# Altium schematic sheet Real Time Clock.SchDoc: Real Time Clock
size A4; SheetNumber: 36; SheetTotal: 37
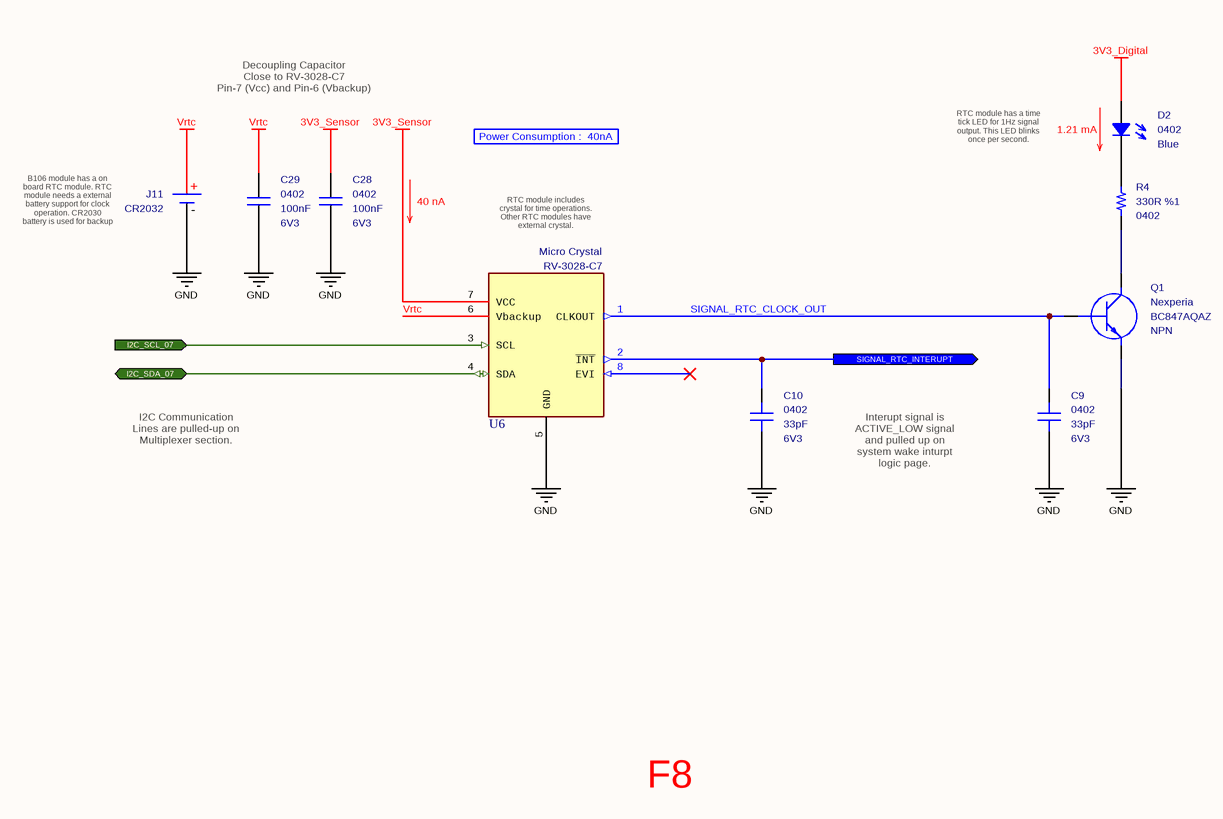
[diagram p0: Real Time Clock.SchDoc]

## Parts
C9  value 33pF  Case: 0402  Voltage: 6V3  [CAPACITOR_0402]  (hidden comment: Multilayer Ceramic Capacitor)
C10  value 33pF  Case: 0402  Voltage: 6V3  [CAPACITOR_0402]  (hidden comment: Multilayer Ceramic Capacitor)
C28  value 100nF  Case: 0402  Voltage: 6V3  [CAPACITOR_0402]  (hidden comment: Multilayer Ceramic Capacitor)
C29  value 100nF  Case: 0402  Voltage: 6V3  [CAPACITOR_0402]  (hidden comment: Multilayer Ceramic Capacitor)
D2  Case: 0402  Color: Blue  [LED_0402]  (hidden comment: SMD LED (Blue))
J11  Battery Size: CR2032  [BATTERY_HOLDER - CR2032]  (hidden comment: Battery Clip Holder and Battery)
Q1  Manufacturer_Name: Nexperia  Manufacturer_Part_Number: BC847AQAZ  Polarity: NPN  [SOT1215]  (hidden comment: Bipolar NPN Transistors)
R4  value 330R  Tolerance: %1  Case: 0402  [RESISTOR_0402]  (hidden comment: Thick Film Resistor)
U6  Manufacturer_Name: Micro Crystal  [RV-3028-C7]  (hidden comment: Real Time Clock)

## Ports
I2C_SCL_07 (in), I2C_SDA_07 (bidir), SIGNAL_RTC_INTERUPT (out)

## Nets
3V3_Digital: D2.2
3V3_Sensor: C28.2 U6.7(VCC)
GND: C9.2 C10.2 C28.1 C29.1 J11.2(BAT-) Q1.2(E) U6.5(GND)
Vrtc: C29.2 J11.1(BAT+) U6.6(Vbackup)
I2C_SCL_07: U6.3(SCL) ; port I2C_SCL_07
I2C_SDA_07: U6.4(SDA) ; port I2C_SDA_07
SIGNAL_RTC_CLOCK_OUT: C9.1 Q1.1(B) U6.1(CLKOUT)
SIGNAL_RTC_INTERUPT: C10.1 U6.2(~{INT}) ; port SIGNAL_RTC_INTERUPT
NetD2_1: D2.1 R4.2
NetQ1_3: Q1.3(C) R4.1

Not connected (* = marked no-connect by the designer): U6 8(EVI)*

## Notes on the sheet
- Decoupling Capacitor
  Close to RV-3028-C7
  Pin-7 (Vcc) and Pin-6 (Vbackup)
- Power Consumption :  40nA
- RTC module has a time tick LED for 1Hz signal output. This LED blinks once per second.
- (near D2) 1.21 mA
- B106 module has a on board RTC module. RTC module needs a external battery support for clock operation. CR2030 battery is used for backup power.
- 40 nA
- RTC module includes crystal for time operations. Other RTC modules have external crystal.
- I2C Communication Lines are pulled-up on Multiplexer section.
- Interupt signal is ACTIVE_LOW signal and pulled up on system wake inturpt logic page.
- F8
- Title
- Size:
- Date:
- A4
- Number:
- Time:
- Revision:
- Sheet
- of
- File:
- (in symbol Connector - Battery Holder (CR2032)) +; -

## Library data of the parts
C9 C10 = Capacitor - 33pF [0402-6V3]: Capacitor - 33pF [0402] (Ceramic); Manufacturer_Name: Kemet; Manufacturer_Part_Number: C0402C330J9RACAUTO; Dielectric: X7R; Tolerance: 10%; Height: 0.5mm; Mouser_Part_Number: 80-C0402C330J9RAUTO; Maximum Operating Temperature: +125; Minimum Operating Temperature: -55; ROHS: Yes; ComponentLink1Description: DataSheet; ComponentLink1URL: https://api.kemet.com/component-edge/download/datasheet/C0402C330J9RACAUTO.pdf; ComponentLink2Description: Mouser; ComponentLink2URL: https://www.mouser.com/Search/Refine.aspx?Keyword=80-C0402C330J9RAUTO; Supplier 1: Mouser; Supplier Part Number 1: 80-C0402C330J9RAUTO
C28 C29 = Capacitor - 100nF [0402-6V3]: Capacitor - 100nF [0402-6V3] (Ceramic); Manufacturer_Name: AVX; Manufacturer_Part_Number: 04026D104KAT4A; Dielectric: X5R; Tolerance: %10; Height: 0.25mm; Mouser_Part_Number: 581-04026D104KAT4A; ComponentLink1Description: Mouser; ComponentLink1URL: https://www.mouser.com.tr/ProductDetail/AVX/04026D104KAT4A?qs=sGAEpiMZZMs0AnBnWHyRQPg4iYkCw7IMED%2F4kpqgf7w%3D; ComponentLink2Description: DataSheet; ComponentLink2URL: https://www.mouser.com.tr/datasheet/2/40/cx5r-776519.pdf; ROHS: Yes; Maximum Operating Temperature: +85; Minimum Operating Temperature: -55; Supplier 1: Avnet; Supplier Part Number 1: 04026D104KAT4A
D2 = Diode - LED (0402-Blue): Standard LEDs - SMD PICOLEDTM;BLUE LED; 25M @ 5MA; Manufacturer_Name: ROHM Semiconductor; Manufacturer_Part_Number: SMLP13BC8TT86; Mouser_Part_Number: 755-SMLP13BC8TT86; ROHS: Yes; ComponentLink1Description: DataSheet; ComponentLink1URL: https://d1d2qsbl8m0m72.cloudfront.net/en/products/databook/datasheet/opto/led/chip_mono/sml-p1-e.pdf; ComponentLink2Description: Mouser; ComponentLink2URL: https://www.mouser.com.tr/ProductDetail/ROHM-Semiconductor/SMLP13BC8TT86?qs=%2Fha2pyFaduidYDgXFKL%252BNZwCVZNUI4FlyPWWbVDx1b6ABmzS%252BS2f0w%3D%3D; Supplier 1: Mouser; Supplier 2: Digi-Key; Supplier Part Number 1: 755-SMLP13BC8TT86; Supplier Part Number 2: 846-1112-1-ND
J11 = Connector - Battery Holder (CR2032): Cylindrical Battery Contacts, Clips, Holders & Springs 16MM - 19MM SM BATTERY CLIP; Manufacturer_Name: Keystone Electronics; Manufacturer_Part_Number: 1070TR; ROHS: Yes; ComponentLink1Description: DataSheet; ComponentLink1URL: https://eu.mouser.com/datasheet/2/215/070-837768.pdf; ComponentLink2Description: Mouser; ComponentLink2URL: https://eu.mouser.com/ProductDetail/Keystone-Electronics/1070TR?qs=sGAEpiMZZMvacfJXZtNRX8uRXKXXLkuh9KDEDSooOoo%3D; Mouser_Part_Number: 534-1070TR; Supplier 1: Farnell; Supplier 2: Digi-Key; Supplier Part Number 1: 2960510; Supplier Part Number 2: 36-1070CT-ND
Q1 = Transistor - BC847: Bipolar Transistors - BJT BC847AQA/DFN1010D-3/REEL 7" Q2; Mouser_Part_Number: 771-BC847AQAZ; ComponentLink1Description: DataSheet; ComponentLink1URL: https://www.mouser.com.tr/datasheet/2/916/BC847XQA_SER-1598405.pdf; ComponentLink2Description: Mouser; ComponentLink2URL: https://www.mouser.com.tr/ProductDetail/Nexperia/BC847AQAZ?qs=%2Fha2pyFaduhKMCPKNtQimeJpXTw9z4AqURd2YARs8DVICZNv3AT9Dw%3D%3D; Case: DFN-1010D-3; Supplier 1: Mouser; Supplier 2: Digi-Key; Supplier Part Number 1: 771-BC847AQAZ; Supplier Part Number 2: 1727-2545-1-ND
R4 = Resistor - 330R: Thick Film Resistors - SMD 1/16 W 330 Ohm 1%; Manufacturer_Name: Vishay; Manufacturer_Part_Number: CRCW0402330RFKED; Height: 0.4mm; Mouser_Part_Number: 71-CRCW0402-330-E3; ComponentLink1Description: DataSheet; ComponentLink1URL: https://www.mouser.com.tr/datasheet/2/427/dcrcwe3-1762152.pdf; ComponentLink2Description: Mouser; ComponentLink2URL: https://www.mouser.com.tr/ProductDetail/Vishay-Dale/CRCW0402330RFKED?qs=sGAEpiMZZMu61qfTUdNhG2DpbjADlD3GGS6SwBlLi5Q%3D; Supplier 1: Mouser; Supplier 2: Digi-Key; Supplier Part Number 2: 541-330LCT-ND; Supplier Part Number 1: 71-CRCW0402-330-E3
U6 = IC - RV-3028-C7: Real Time Clock 32.768kHz I2C Time Acc. 1ppm; Mouser_Part_Number: 428-203591-MG01; ComponentLink1Description: DataSheet; ComponentLink1URL: https://eu.mouser.com/datasheet/2/530/RV-3028-C7-1524919.pdf; ComponentLink2Description: Mouser; ComponentLink2URL: https://eu.mouser.com/ProductDetail/Micro-Crystal/RV-3028-C7-32768kHz-1ppm-TA-QC?qs=sGAEpiMZZMtpeOq%2F1QMb1b6mUOvJOzpDTOpQRtK3%252B9k%3D; Minimum Operating Temperature: -40; Maximum Operating Temperature: +85; Supplier 1: Digi-Key; Supplier Part Number 1: 2195-RV-3028-C732.768KHZ1PPM-TA-QCCT-ND; Case: SMD; Manufacturer_Part_Number: RV-3028-C7